# EAGLE schematic Modemplatine_modem (EAGLE 5.11)
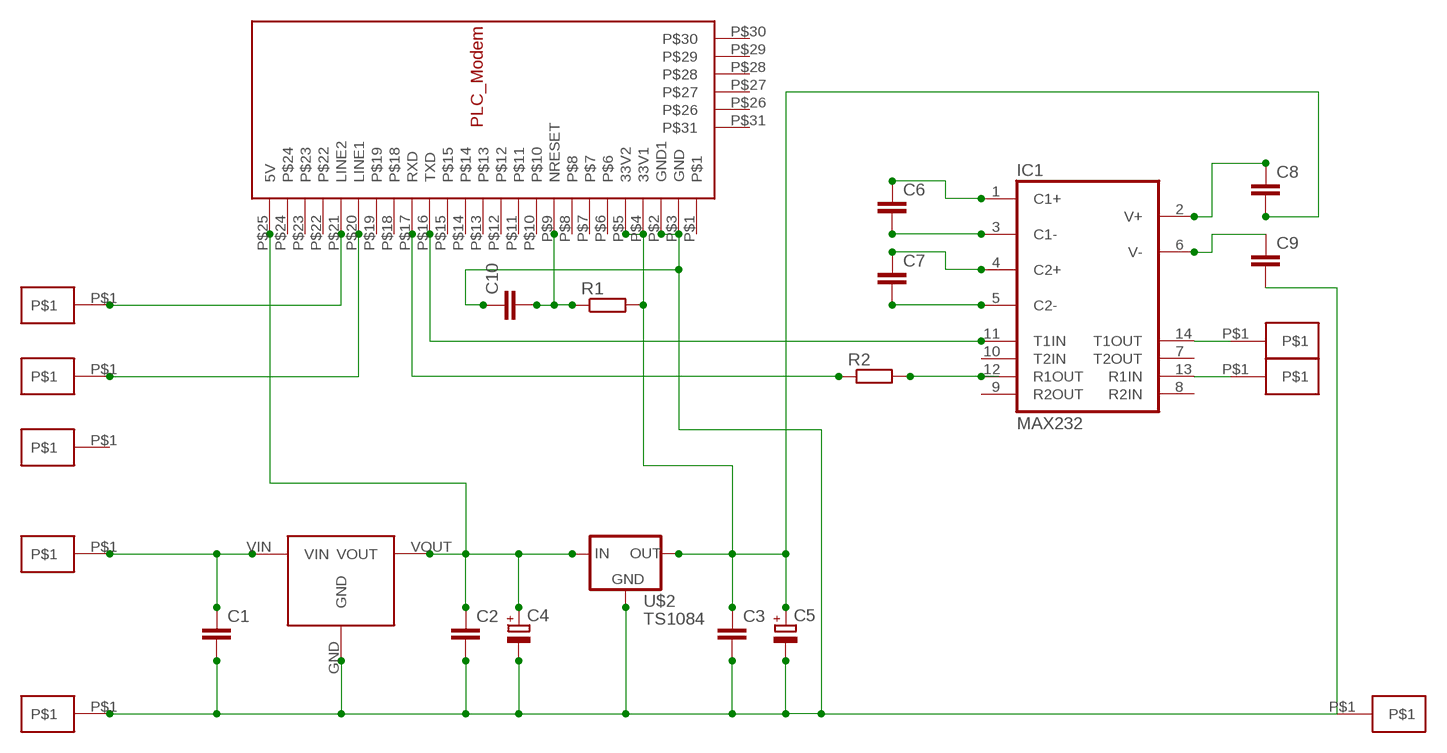
[diagram p0: schematic, sheet 1]

## Parts
C1  C2.5/5  [C2.5-5]
C2  C2.5/5  [C2.5-5]
C3  C2.5/5  [C2.5-5]
C4  CPOL-EUE2.5-5  [E2,5-5]
C5  CPOL-EUE2.5-5  [E2,5-5]
C6  C-EU025-040X050  [C025-040X050]
C7  C-EU025-040X050  [C025-040X050]
C8  C-EU025-040X050  [C025-040X050]
C9  C-EU025-040X050  [C025-040X050]
C10  C-EU025-040X050  [C025-040X050]
IC1  MAX232  [DIL16]
LINE1  PN4  [PIN2]
LINE2  PN4  [PIN2]
R1  R-EU_0207/10  [0207/10]
R2  R-EU_0207/10  [0207/10]
U$1  RECOM_785_05  [RECOM785X]
U$2  TS1084  [TS1084]
U$3  MODEMSTECKER  [MODEM_FUSS]
U$4  PN4  [PIN2]
U$5  PN4  [PIN2]
U$6  PN4  [PIN2]
U$7  PN4  [PIN2]
U$8  PN4  [PIN2]
U$11  PN4  [PIN2]

## Nets
N$1: C1.1 U$1.VIN U$5.P$1
N$2: C1.2 C2.2 C3.2 C4.- C5.- C9.2 C10.1 U$1.GND U$2.1GND(GND) U$3.P$2(GND1) U$3.P$3(GND) U$4.P$1 U$8.P$1
N$3: C2.1 C4.+ U$1.VOUT U$2.3IN(IN) U$3.P$25(5V)
N$4: C3.1 C5.+ C8.2 R1.2 U$2.2OUT(OUT) U$3.P$4(33V1) U$3.P$5(33V2)
N$5: LINE2.P$1 U$3.P$21(LINE2)
N$6: LINE1.P$1 U$3.P$20(LINE1)
N$7: C6.1 IC1.1(C1+)
N$8: C6.2 IC1.3(C1-)
N$9: C7.1 IC1.4(C2+)
N$10: C7.2 IC1.5(C2-)
N$11: C8.1 IC1.2(V+)
N$12: C9.1 IC1.6(V-)
N$14: IC1.14(T1OUT) U$6.P$1
N$15: IC1.13(R1IN) U$7.P$1
N$16: IC1.11(T1IN) U$3.P$16(TXD)
N$17: IC1.12(R1OUT) R2.2
N$18: R2.1 U$3.P$17(RXD)
N$19: C10.2 R1.1 U$3.P$9(NRESET)
Unconnected: IC1.7(T2OUT) IC1.8(R2IN) IC1.9(R2OUT) IC1.10(T2IN) U$3.P$1 U$3.P$6 U$3.P$7 U$3.P$8 U$3.P$10 U$3.P$11 U$3.P$12 U$3.P$13 U$3.P$14 U$3.P$15 U$3.P$18 U$3.P$19 U$3.P$22 U$3.P$23 U$3.P$24 U$3.P$26 U$3.P$27 U$3.P$28 U$3.P$29 U$3.P$30 U$3.P$31 U$11.P$1

## Power pins joined to a net without a drawn wire
GND: IC1.15(GND)
VCC: IC1.16(VCC)

## Library data of the parts
C1-C3 = capacitor-wima:C: CAPACITOR naming: grid - package width
C4 C5 = resistor:CPOL-EU: POLARIZED CAPACITOR, European symbol
C6-C10 = resistor:C-EU: CAPACITOR, European symbol
IC1 = maxim:MAX232: RS232 TRANSEIVER; MF: MAXIM; MPN: MAX232ACPE+; OC_FARNELL: 9723773; OC_NEWARK: 68K4544
LINE1 LINE2 U$4-U$8 U$11 = Strommessung:PN4
R1 R2 = resistor:R-EU_: RESISTOR, European symbol
U$1 = ADS:RECOM_785_05
U$2 = ADS1:TS1084
U$3 = ADS:MODEMSTECKER